# Altium schematic sheet Linear Voltage Regulator.SchDoc
size A
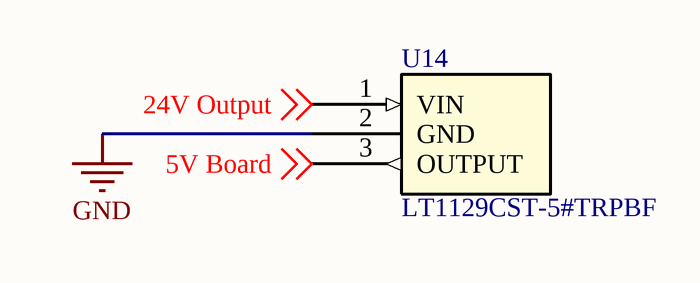
[diagram p0: Linear Voltage Regulator.SchDoc]

## Parts
U14  LT1129CST-5#TRPBF  [SOT-223_ST-M]

## Nets
GND: U14.2(GND)
5V Board: U14.3(OUTPUT) ; off-sheet 5V Board
24V Output: U14.1(VIN) ; off-sheet 24V Output

## Library data of the parts
U14 = LT1129CST-5#TRPB: No Description Available; Vendor: Linear Technology; Built_By: EMA_UL_Team; Manufacturer_Part_Number: LT1129CST-5#TRPBF; Copyright: Copyright (C) 2018 Accelerated Designs. All rights reserved; RefDes: RefDes; Type: DEV; Value: Value